# Altium schematic sheet JL2.SchDoc
size A3
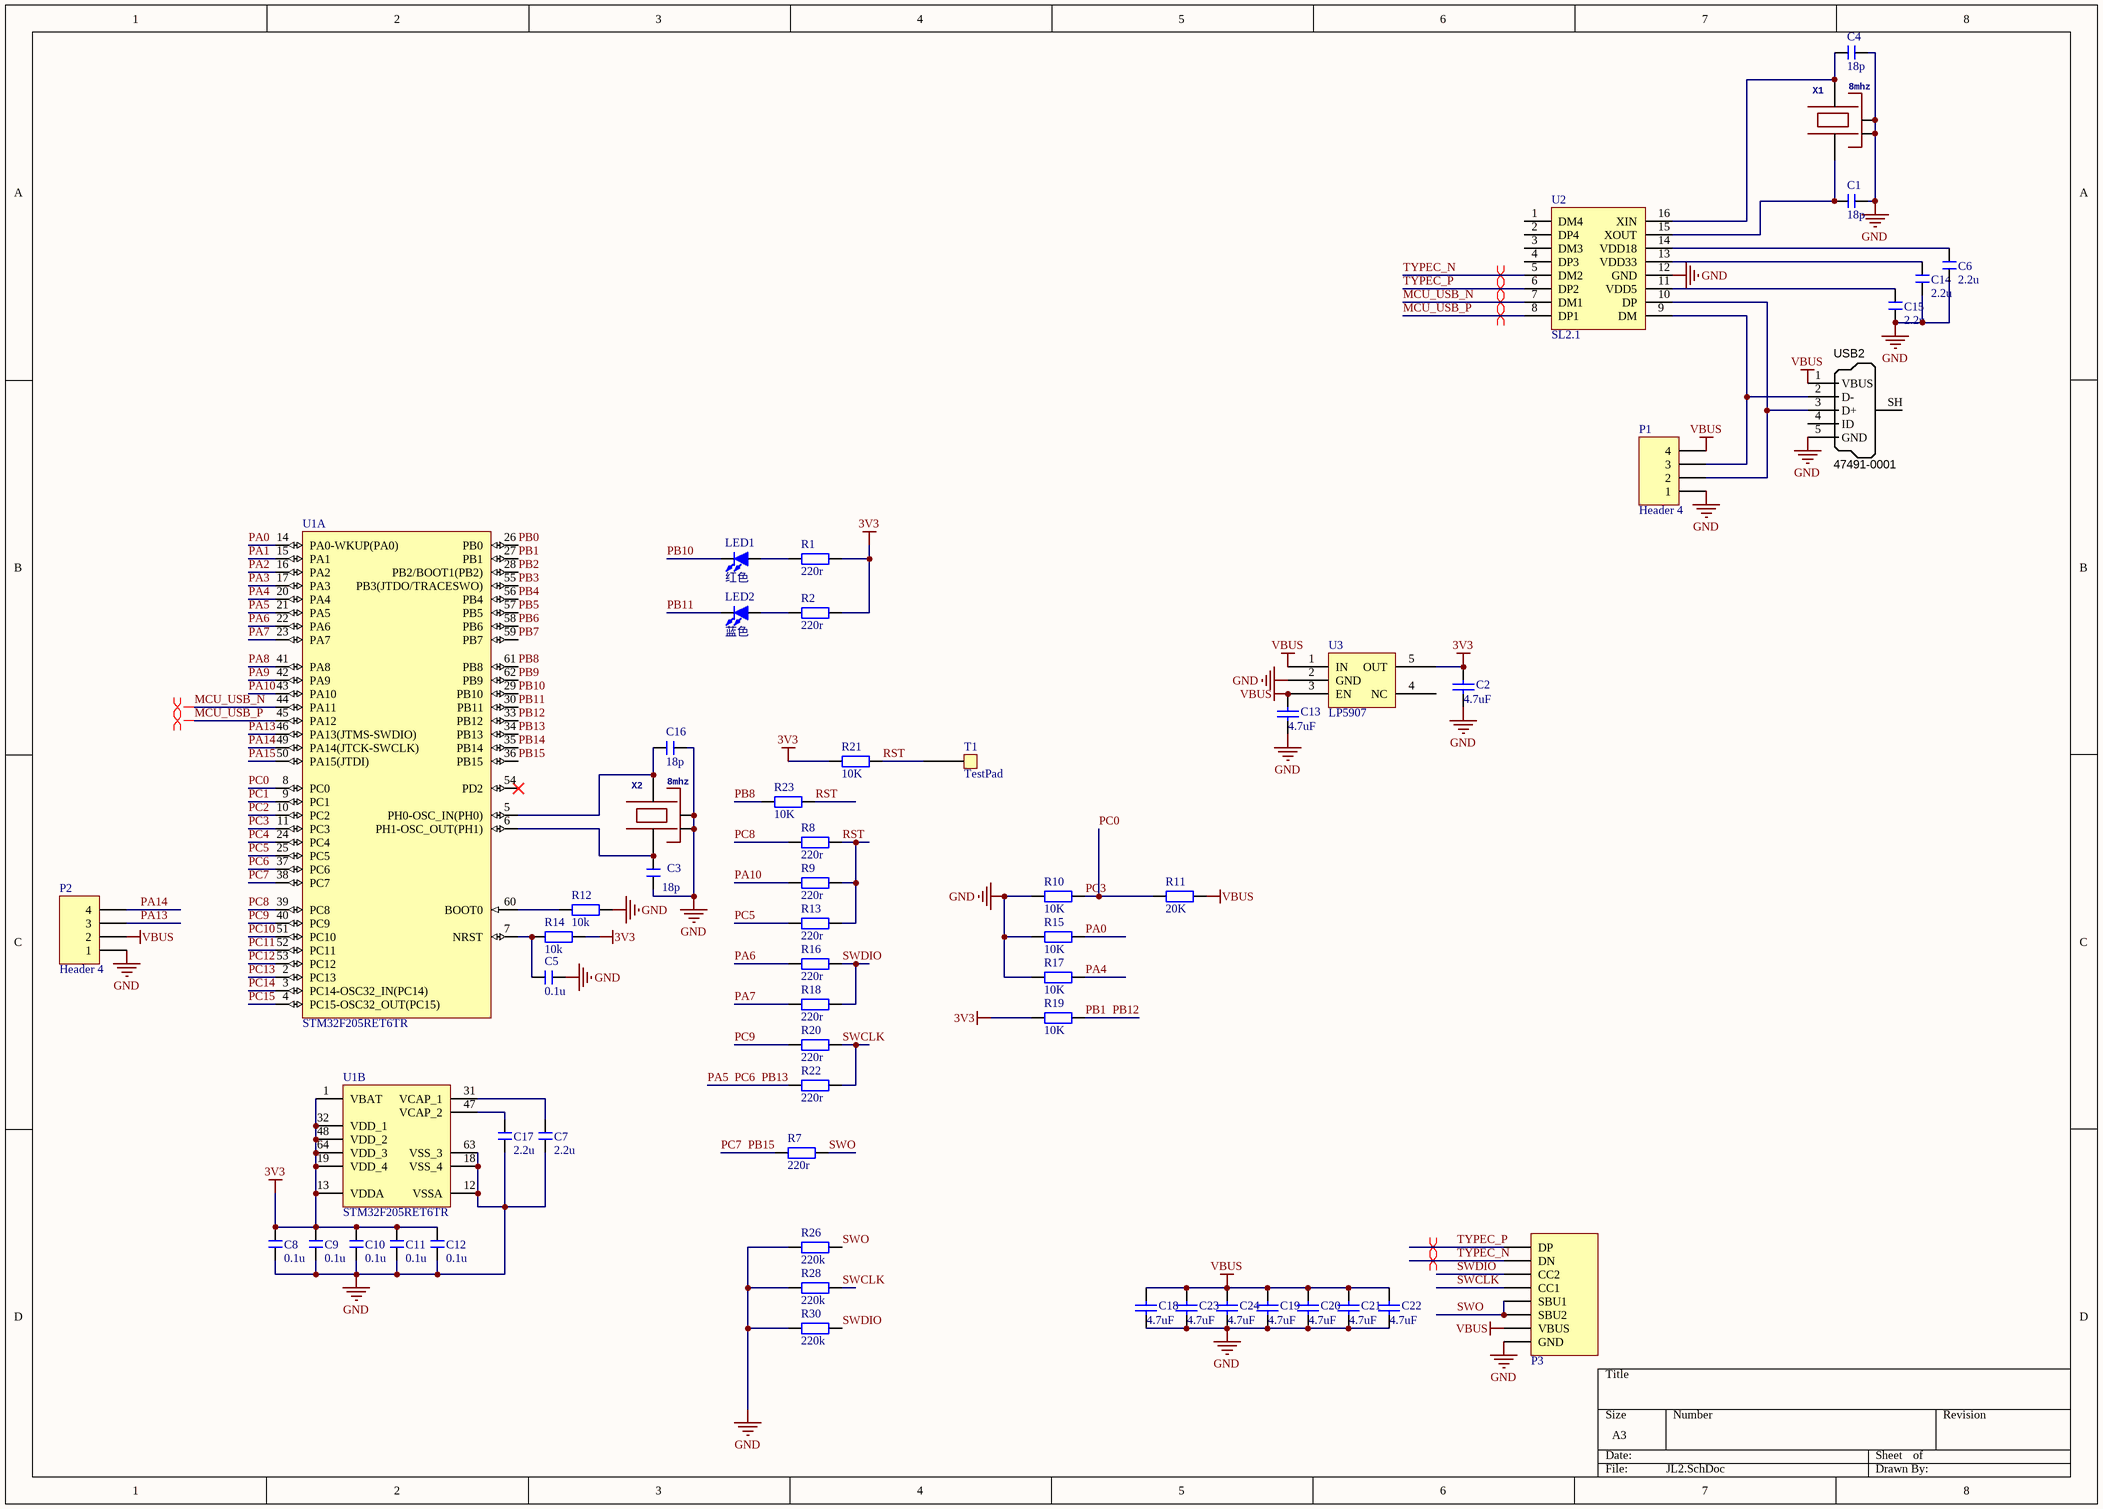
[diagram p0: JL2.SchDoc]

## Parts
C1  18p  [0402]
C2  4.7uF  [0603]
C3  18p  [0402]
C4  18p  [0402]
C5  0.1u  [0402]
C6  2.2u  [0603]
C7  2.2u  [0603]
C8  0.1u  [0402]
C9  0.1u  [0402]
C10  0.1u  [0402]
C11  0.1u  [0402]
C12  0.1u  [0402]
C13  4.7uF  [0603]
C14  2.2u  [0603]
C15  2.2u  [0603]
C16  18p  [0402]
C17  2.2u  [0603]
C18  4.7uF  [0603]
C19  4.7uF  [0603]
C20  4.7uF  [0603]
C21  4.7uF  [0603]
C22  4.7uF  [0603]
C23  4.7uF  [0603]
C24  4.7uF  [0603]
LED1  红色  [0603]
LED2  蓝色  [0603]
P1  Header 4  [HDR1X4]
P2  Header 4  [HDR1X4]
P3  USBC  [USBTC]  (value not drawn)
R1  220r  [0402]
R2  220r  [0402]
R7  220r  [0402]
R8  220r  [0402]
R9  220r  [0402]
R10  10K  [0402]
R11  20K  [0402]
R12  10k  [0402]
R13  220r  [0402]
R14  10k  [0402]
R15  10K  [0402]
R16  220r  [0402]
R17  10K  [0402]
R18  220r  [0402]
R19  10K  [0402]
R20  220r  [0402]
R21  10K  [0402]
R22  220r  [0402]
R23  10K  [0402]
R26  220k  [0402]
R28  220k  [0402]
R30  220k  [0402]
T1  TestPad  [TestPad - 1mm]
U1  STM32F205RET6TR  [LQFP64 10X10_L]  (parts A,B of 2)
U2  SL2.1  [SOP16]
U3  LP5907  [SOT23-5]
USB2  Manufacturer Part Number 1: 47491-0001  [MICRO-YZX]  (hidden comment: USB Micro Type B)
X1  8mhz  [OSCILLATOR-3.2X2.5]
X2  8mhz  [OSCILLATOR-3.2X2.5]

## Nets
3V3: C2.2 C8.2 C9.2 C10.2 C11.2 C12.2 R1.1 R2.1 R14.1 R19.2 R21.2 U1.1(VBAT) U1.13(VDDA) U1.19(VDD_4) U1.32(VDD_1) U1.48(VDD_2) U1.64(VDD_3) U3.5(OUT)
GND: C1.2 C2.1 C3.2 C4.2 C5.1 C6.1 C7.1 C8.1 C9.1 C10.1 C11.1 C12.1 C13.1 C14.1 C15.1 C16.2 C17.1 C18.1 C19.1 C20.1 C21.1 C22.1 C23.1 C24.1 P1.1 P2.1 P3.GND R10.2 R12.1 R15.2 R17.2 R26.2 R28.2 R30.2 U1.12(VSSA) U1.18(VSS_4) U1.63(VSS_3) U2.12(GND) U3.2(GND) USB2.5(GND) X1.2(NC_2) X1.4(NC_4) X2.2(NC_2) X2.4(NC_4)
VBUS: C13.2 C18.2 C19.2 C20.2 C21.2 C22.2 C23.2 C24.2 P1.4 P2.2 P3.VBUS R11.1 U3.1(IN) U3.3(EN) USB2.1(VBUS)
MCU_USB_N: U1.44(PA11) U2.7(DM1)
MCU_USB_P: U1.45(PA12) U2.8(DP1)
PA0: R15.1 U1.14(PA0-WKUP(PA0))
PA1: U1.15(PA1)
PA2: U1.16(PA2)
PA3: U1.17(PA3)
PA4: R17.1 U1.20(PA4)
PA5: R22.2 U1.21(PA5) U1.34(PB13) U1.37(PC6)  [also labelled PB13, PC6]
PA6: R16.2 U1.22(PA6)
PA7: R18.2 U1.23(PA7)
PA8: U1.41(PA8)
PA9: U1.42(PA9)
PA10: R9.2 U1.43(PA10)
PA13: P2.3 U1.46(PA13(JTMS-SWDIO))
PA14: P2.4 U1.49(PA14(JTCK-SWCLK))
PA15: U1.50(PA15(JTDI))
PB0: U1.26(PB0)
PB1: R19.1 U1.27(PB1) U1.33(PB12)  [also labelled PB12]
PB2: U1.28(PB2/BOOT1(PB2))
PB3: U1.55(PB3(JTDO/TRACESWO))
PB4: U1.56(PB4)
PB5: U1.57(PB5)
PB6: U1.58(PB6)
PB7: U1.59(PB7)
PB8: R23.2 U1.61(PB8)
PB9: U1.62(PB9)
PB10: LED1.2(K) U1.29(PB10)
PB11: LED2.2(K) U1.30(PB11)
PB14: U1.35(PB14)
PB15: R7.2 U1.36(PB15) U1.38(PC7)  [also labelled PC7]
PC0: R10.1 R11.2 U1.8(PC0) U1.11(PC3)  [also labelled PC3]
PC1: U1.9(PC1)
PC2: U1.10(PC2)
PC4: U1.24(PC4)
PC5: R13.2 U1.25(PC5)
PC8: R8.2 U1.39(PC8)
PC9: R20.2 U1.40(PC9)
PC10: U1.51(PC10)
PC11: U1.52(PC11)
PC12: U1.53(PC12)
PC13: U1.2(PC13)
PC14: U1.3(PC14-OSC32_IN(PC14))
PC15: U1.4(PC15-OSC32_OUT(PC15))
RST: R8.1 R9.1 R13.1 R21.1 R23.1 T1.1
SWCLK: P3.CC1 R20.1 R22.1 R28.1
SWDIO: P3.CC2 R16.1 R18.1 R30.1
SWO: P3.SBU1 P3.SBU2 R7.1 R26.1
TYPEC_N: P3.DN U2.5(DM2)
TYPEC_P: P3.DP U2.6(DP2)
NetC1_1: C1.1 U2.15(XOUT) X1.1
NetC3_1: C3.1 U1.6(PH1-OSC_OUT(PH1)) X2.1
NetC4_1: C4.1 U2.16(XIN) X1.3
NetC5_2: C5.2 R14.2 U1.7(NRST)
NetC6_2: C6.2 U2.14(VDD18)
NetC7_2: C7.2 U1.31(VCAP_1)
NetC14_2: C14.2 U2.13(VDD33)
NetC15_2: C15.2 U2.11(VDD5)
NetC16_1: C16.1 U1.5(PH0-OSC_IN(PH0)) X2.3
NetC17_2: C17.2 U1.47(VCAP_2)
NetLED1_1: LED1.1(A) R1.2
NetLED2_1: LED2.1(A) R2.2
NetP1_2: P1.2 U2.10(DP) USB2.3(D+)
NetP1_3: P1.3 U2.9(DM) USB2.2(D-)
NetR12_2: R12.2 U1.60(BOOT0)

Not connected (* = marked no-connect by the designer): U1 54(PD2)*; U2 1(DM4) 2(DP4) 3(DM3) 4(DP3); U3 4(NC); USB2 4(ID) SH(Shell)

## Layout directives
differential pair: MCU_USB_N, MCU_USB_P, TYPEC_N, TYPEC_P

## Library data of the parts
C1 C3-C12 C14-C17 = C: 无极性贴片电容; 版权归属: 黎明电子style; BOM名称: 无极性贴片电容; 学习资源: https://lmdzstyle.taobao.com/
C2 C13 C18-C24 = Cap: Capacitor; Published: 8-Jun-2000; LatestRevisionDate: 17-Jul-2002; LatestRevisionNote: Re-released for DXP Platform.; PackageReference: RAD-0.3; Publisher: Altium Limited; PackageDescription: Radial Cap, Thru-Hole; 2 Leads; 0.3 in Pin Spacing
LED1 LED2 = LED-SMD: 贴片LED; 版权归属: 黎明电子style; BOM名称: 贴片LED; 学习资源: https://lmdzstyle.taobao.com/
P1 P2 = Header 4: Header, 4-Pin; LatestRevisionDate: 17-Jul-2002; LatestRevisionNote: Re-released for DXP Platform.; Publisher: Altium Limited
R1 R2 R7-R23 R26 R28 R30 = R: 贴片电阻; 版权归属: 黎明电子style; BOM名称: 贴片电阻; 学习资源: https://lmdzstyle.taobao.com/
U1 = STM32F205RET6TR: ARM Cortex-M3 32-bit MCU, 512 KB Flash, 128 KB Internal RAM, 51 I/Os, 64-pin LQFP, -40 to 85 degC, Tape and Reel; D/A Converter: 2x12-bit (2 Channel); FLASH Size (Prog) (kB): 512; I/Os (High Current): 51; Internal RAM Size (kB): 128; Operating Frequency(F) (Processor speed) (MHz): 120; Supply Voltage(Vcc) min (V): 1.8; DatasheetVersion: Rev. 9; PackageVersion: Rev. 4, 06/2013; PackageReference: LQFP64; PackageDescription: 64-Pin Low Profile Quad Flat Package, 10 x 10 mm Body, 0.5 mm Pitch; Supplier 1: Digi-Key; Supplier Part Number 1: STM32F205RET6TR-ND; Supplier 2: Newark; Supplier Part Number 2: 48W6872; Supplier 3: Mouser; Supplier Part Number 3: 511-STM32F205RET6TR; Core: ARM Cortex-M3; Packing: Tape and Reel; Mounting Technology: Surface Mount; PartNumber: STM32F205RET6TR; ComponentLink1Description: Manufacturer URL; ComponentLink1URL: http://www.st.com/web/en/home.html; ComponentLink2Description: Datasheet; ComponentLink2URL: http://www.st.com/st-web-ui/static/active/en/resource/technical/document/datasheet/CD00237391.pdf; ComponentLink3Description: Package Specification; ComponentLink3URL: http://www.st.com/st-web-ui/static/active/en/resource/technical/document/datasheet/DM00037051.pdf
USB2 = USB_Micro_TypeB: Connector SMD USB Micro Type B middle mount; Manufacturer 1: Molex Inc; SCDType: undef; Package / Case: SMD; Supplier 1: Digi-Key; Supplier Part Number 1: WM17142CT-ND
X1 X2 = OSCILLATOR-3.2X2.5: Crystal Oscillator in 3.2x2.5 SMD